# EAGLE design plc-3u-c-r1 (EAGLE 4.16)
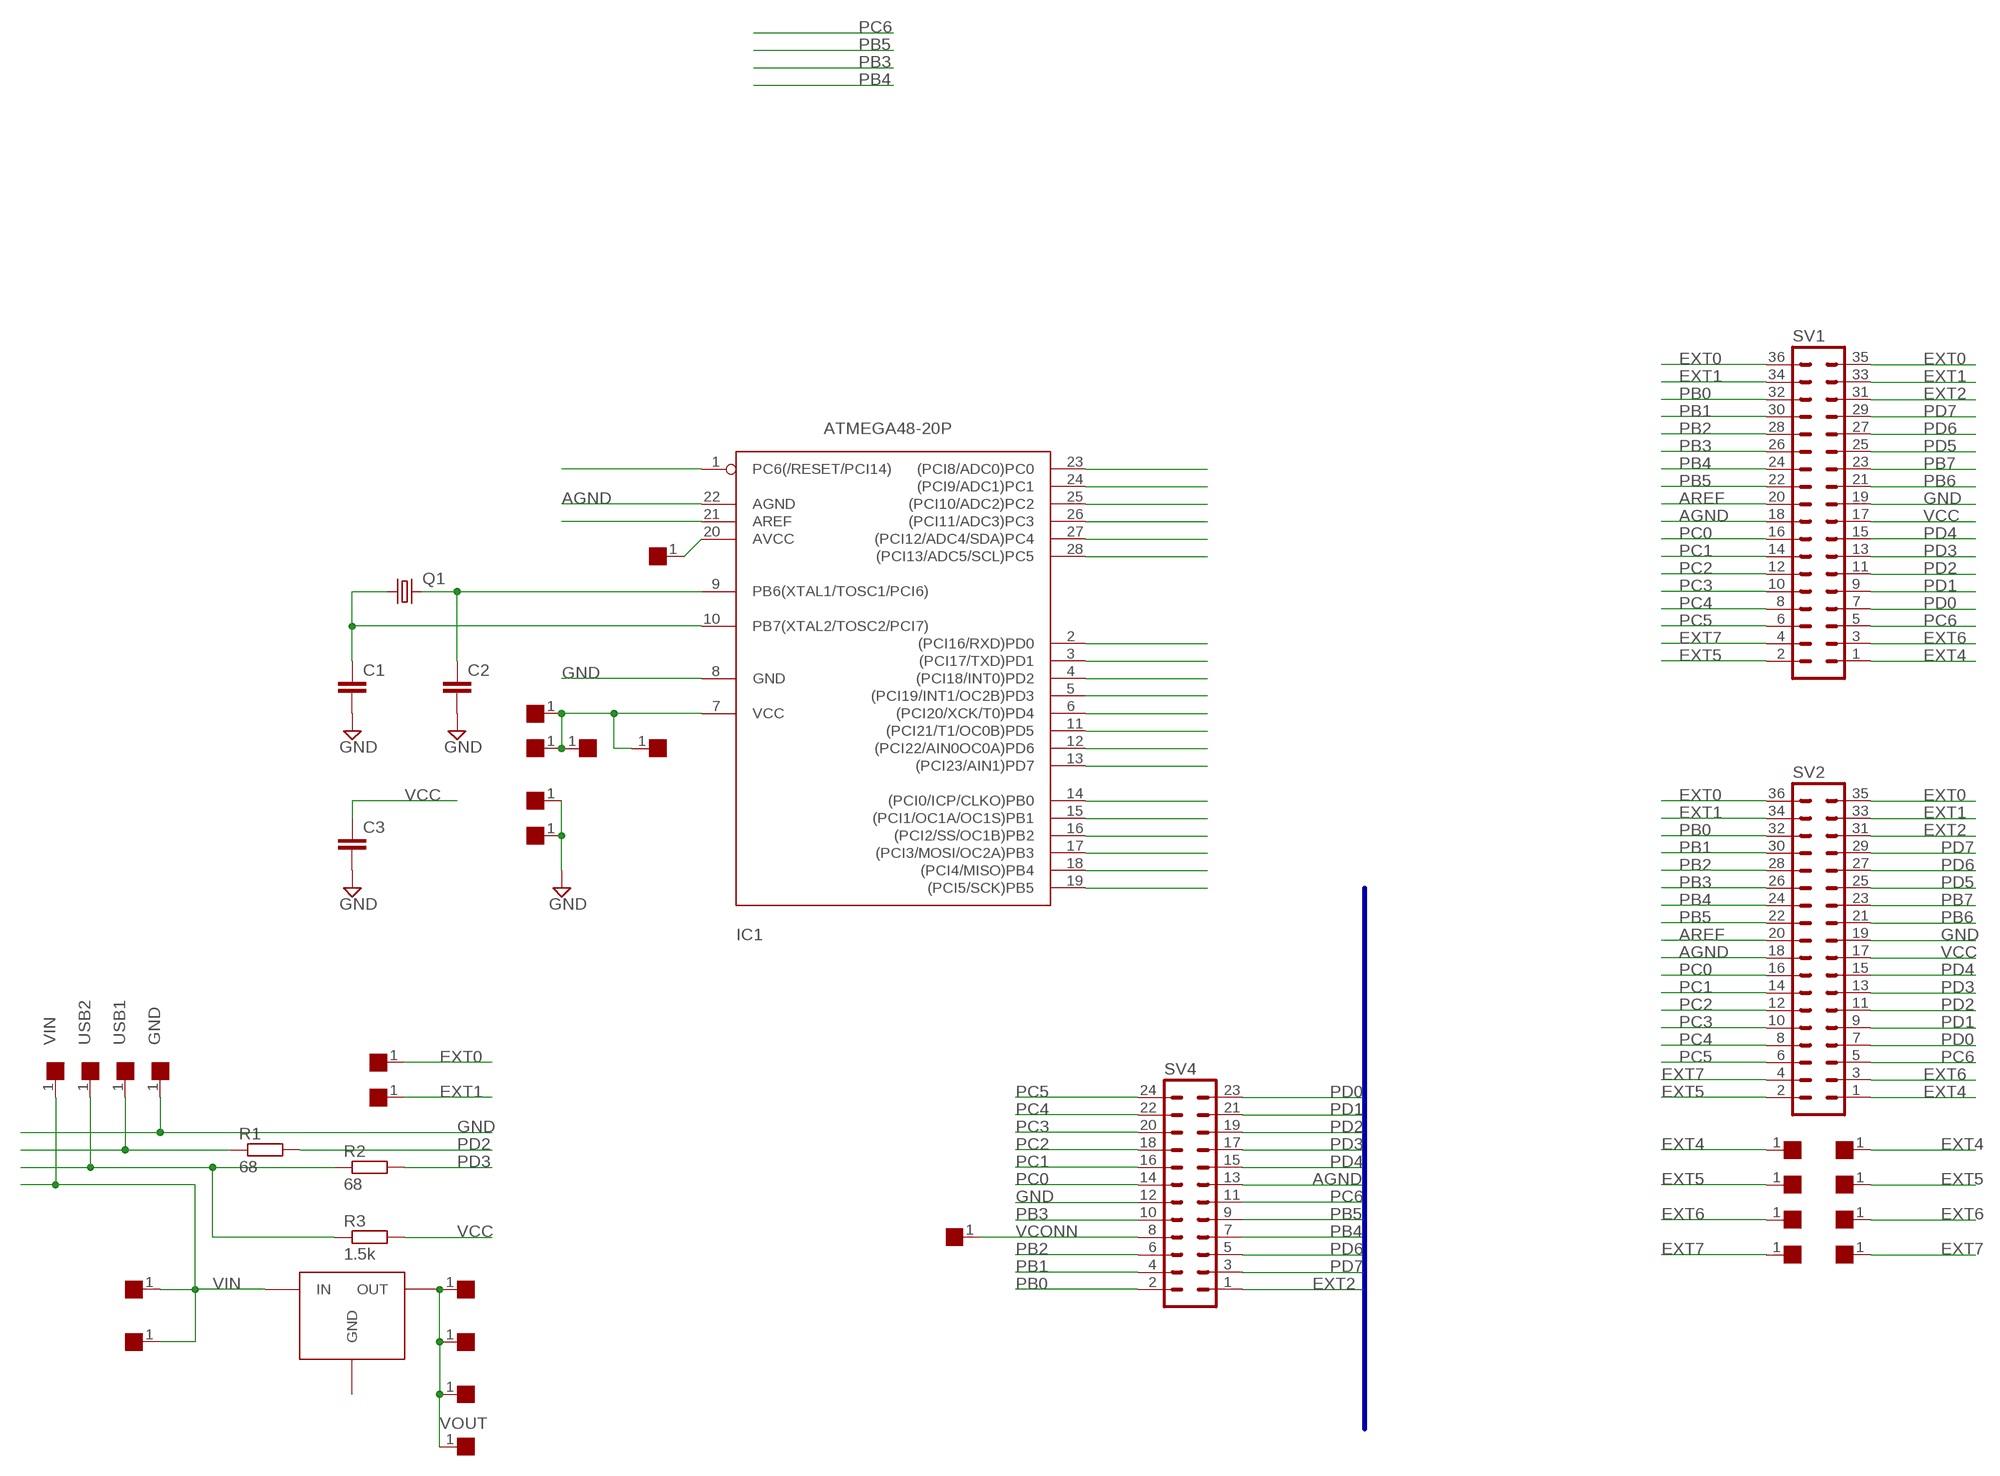
[diagram p0: schematic, sheet 1]

## Parts
C1  C-EUC0805  [C0805]
C2  C-EUC0805  [C0805]
C3  C-EUC1206  [C1206]
IC1  ATMEGA48-20P  [DIL28-3]
Q1  CRYSTALHC49S  [HC49/S]
R1  68  R-EU_R0805  [R0805]
R2  68  R-EU_R0805  [R0805]
R3  1.5k  R-EU_R0805  [R0805]
SV1  MA18-2  [MA18-2]
SV2  MA18-2  [MA18-2]
SV4  MA12-2W  [MA12-2W]
T1  TESTPOINT  [TESTPOIN]
T2  TESTPOINT  [TESTPOIN]
T3  TESTPOINT  [TESTPOIN]
T4  TESTPOINT  [TESTPOIN]
T5  TESTPOINT  [TESTPOIN]
T6  TESTPOINT  [TESTPOIN]
T7  TESTPOINT  [TESTPOIN]
T8  TESTPOINT  [TESTPOIN]
T9  TESTPOINT  [TESTPOIN]
T10  TESTPOINT  [TESTPOIN]
T11  TESTPOINT  [TESTPOIN]
T12  TESTPOINT  [TESTPOIN]
T13  TESTPOINT  [TESTPOIN]
T14  TESTPOINT  [TESTPOIN]
T15  TESTPOINT  [TESTPOIN]
T16  TESTPOINT  [TESTPOIN]
T17  TESTPOINT  [TESTPOIN]
T18  TESTPOINT  [TESTPOIN]
T19  TESTPOINT  [TESTPOIN]
T20  TESTPOINT  [TESTPOIN]
T21  TESTPOINT  [TESTPOIN]
T22  TESTPOINT  [TESTPOIN]
T23  TESTPOINT  [TESTPOIN]
T24  TESTPOINT  [TESTPOIN]
T25  TESTPOINT  [TESTPOIN]
T26  TESTPOINT  [TESTPOIN]
T27  TESTPOINT  [TESTPOIN]
T28  TESTPOINT  [TESTPOIN]
U$1  LF33CDT  [TO-252]

## Nets
AGND: IC1.22(AGND) SV1.18 SV2.18 SV4.13
AREF: IC1.21(AREF) SV1.20 SV2.20
EXT0: SV1.35 SV1.36 SV2.35 SV2.36 T10.1
EXT1: SV1.33 SV1.34 SV2.33 SV2.34 T11.1
EXT2: SV1.31 SV2.31 SV4.1
EXT4: SV1.1 SV2.1 T12.1 T16.1
EXT5: SV1.2 SV2.2 T13.1 T17.1
EXT6: SV1.3 SV2.3 T14.1 T18.1
EXT7: SV1.4 SV2.4 T15.1 T19.1
GND: C1.2 C2.2 C3.2 IC1.8(GND) SV1.19 SV2.19 SV4.12 T7.1 T8.1 T23.1
N$3: IC1.4((PCI18/INT0)PD2)
N$7: IC1.20(AVCC) T2.1
PB0: IC1.14((PCI0/ICP/CLKO)PB0) SV1.32 SV2.32 SV4.2
PB1: IC1.15((PCI1/OC1A/OC1S)PB1) SV1.30 SV2.30 SV4.4
PB2: IC1.16((PCI2/SS/OC1B)PB2) SV1.28 SV2.28 SV4.6
PB3: IC1.17((PCI3/MOSI/OC2A)PB3) SV1.26 SV2.26 SV4.10
PB4: IC1.18((PCI4/MISO)PB4) SV1.24 SV2.24 SV4.7
PB5: IC1.19((PCI5/SCK)PB5) SV1.22 SV2.22 SV4.9
PB6: C2.1 IC1.9(PB6(XTAL1/TOSC1/PCI6)) Q1.2 SV1.21 SV2.21
PB7: C1.1 IC1.10(PB7(XTAL2/TOSC2/PCI7)) Q1.1 SV1.23 SV2.23
PC0: IC1.23((PCI8/ADC0)PC0) SV1.16 SV2.16 SV4.14
PC1: IC1.24((PCI9/ADC1)PC1) SV1.14 SV2.14 SV4.16
PC2: IC1.25((PCI10/ADC2)PC2) SV1.12 SV2.12 SV4.18
PC3: IC1.26((PCI11/ADC3)PC3) SV1.10 SV2.10 SV4.20
PC4: IC1.27((PCI12/ADC4/SDA)PC4) SV1.8 SV2.8 SV4.22
PC5: IC1.28((PCI13/ADC5/SCL)PC5) SV1.6 SV2.6 SV4.24
PC6: IC1.1(PC6(/RESET/PCI14)) SV1.5 SV2.5 SV4.11
PD0: IC1.2((PCI16/RXD)PD0) SV1.7 SV2.7 SV4.23
PD1: IC1.3((PCI17/TXD)PD1) SV1.9 SV2.9 SV4.21
PD2: R1.2 SV1.11 SV2.11 SV4.19
PD3: IC1.5((PCI19/INT1/OC2B)PD3) R2.2 SV1.13 SV2.13 SV4.17
PD4: IC1.6((PCI20/XCK/T0)PD4) SV1.15 SV2.15 SV4.15
PD5: IC1.11((PCI21/T1/OC0B)PD5) SV1.25 SV2.25
PD6: IC1.12((PCI22/AIN0OC0A)PD6) SV1.27 SV2.27 SV4.5
PD7: IC1.13((PCI23/AIN1)PD7) SV1.29 SV2.29 SV4.3
USB1: R1.1 T22.1
USB2: R2.1 R3.1 T21.1
VCC: C3.1 IC1.7(VCC) R3.2 SV1.17 SV2.17 T1.1 T4.1 T5.1 T25.1
VCONN: SV4.8 T28.1
VIN: T20.1 T24.1 T27.1 U$1.1(IN)
VOUT: T3.1 T6.1 T9.1 T26.1 U$1.2(OUT)

## Buses
EXT[0..7]

## Power pins joined to a net without a drawn wire
GND: U$1.3(GND)

## Library data of the parts
C1-C3 = rcl:C-EU: CAPACITOR, European symbol
IC1 = avr:ATMEGA48*P: MICROCONTROLLER 4 Kbytes FLASH 512 Bytes SRAM 256 Bytes EEPROM USART 8-channel 10 bit ADC
Q1 = crystal:CRYSTAL: CRYSTAL
R1-R3 = rcl:R-EU_: RESISTOR, European symbol
SV1 SV2 = con-lstb:MA18-2: PIN HEADER
SV4 = con-lstb:MA12-2W: PIN HEADER
T1-T28 = ADS:TESTPOINT
U$1 = my-to252:LF33CDT

## Board
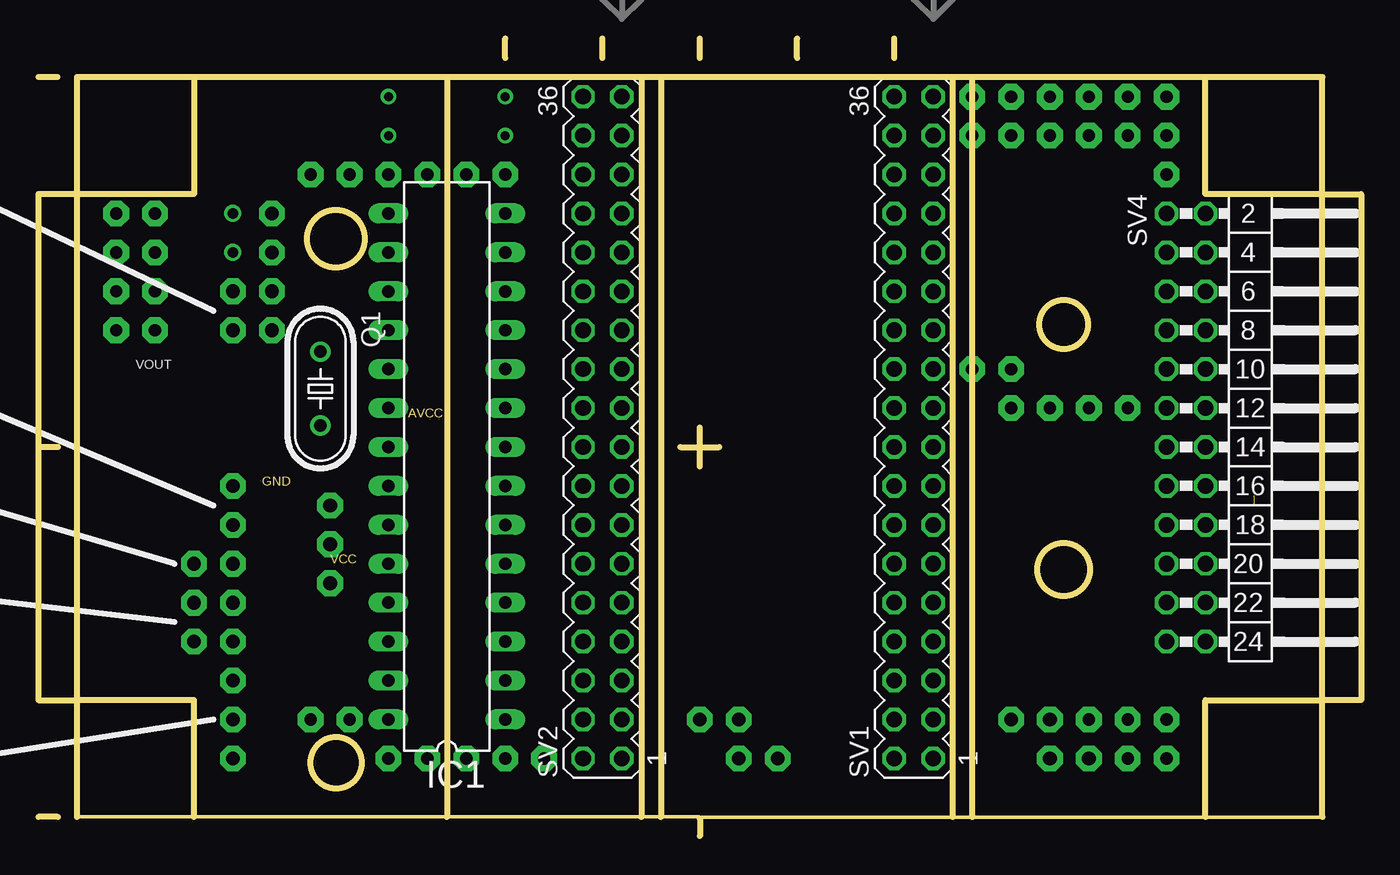
[diagram p1: board, top side]
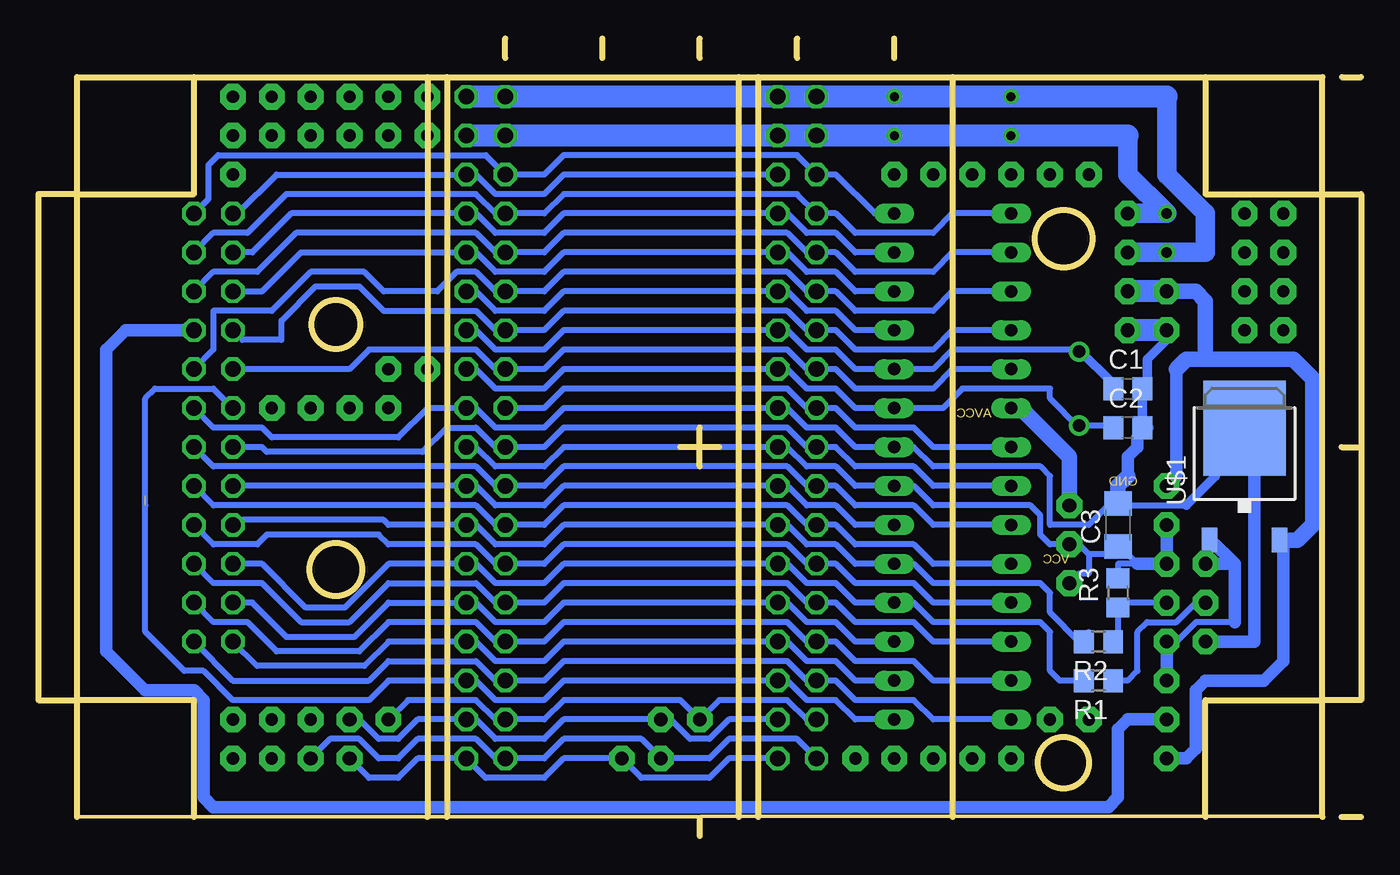
[diagram p2: board, bottom side, seen from below]

Size 86.36 x 52.07 mm. Coordinates in mm from the lower left corner, seen from the top.
Outline: 2.54,1.29 83.82,1.25
Outline: 43.18,1.13 43.18,0
Outline: 1.27,49.53 0,49.53
Outline: 1.27,1.27 0,1.27
Outline: 1.27,25.4 0,25.4
Outline: 41.91,25.4 44.45,25.4
Outline: 43.18,24.13 43.18,26.67
Outline: 2.54,1.27 2.54,8.89
Outline: 2.54,8.89 2.54,41.91
Outline: 2.54,41.91 2.54,49.53 10.16,49.53
Outline: 83.82,1.27 83.82,8.89
Outline: 83.82,8.89 83.82,41.91
Outline: 83.82,41.91 83.82,49.53 76.2,49.53
Outline: 76.2,49.53 60.96,49.53
Outline: 60.96,49.53 59.69,49.53
Outline: 59.69,49.53 40.64,49.53
Outline: 40.64,49.53 39.37,49.53
Outline: 39.37,49.53 26.67,49.53
Outline: 26.67,49.53 10.16,49.53
Outline: 10.16,1.27 10.16,8.89 2.54,8.89
Outline: 76.2,1.27 76.2,8.89 83.82,8.89
Outline: 83.82,41.91 76.2,41.91 76.2,49.53
Outline: 10.16,49.53 10.16,41.91 2.54,41.91
Outline: 2.54,41.91 0,41.91 0,8.89 2.54,8.89
Outline: 83.82,41.91 86.36,41.91 86.36,8.89 83.82,8.89
Outline: 26.67,49.53 26.67,1.27
Outline: 43.18,50.8 43.18,52.07
Outline: 59.69,49.53 59.69,1.27
Outline: 60.96,49.53 60.96,1.27
Outline: 49.53,50.8 49.53,52.07
Outline: 55.88,50.8 55.88,52.07
Outline: 36.83,50.8 36.83,52.07
Outline: 30.48,50.8 30.48,52.07
Outline: 39.37,49.53 39.37,1.27
Outline: 40.64,49.53 40.64,1.27
Outline: circle at 19.43,39 radius 1.86
Outline: circle at 19.43,4.8 radius 1.66
Outline: circle at 66.93,17.4 radius 1.71
Outline: circle at 66.93,33.4 radius 1.57
Copper layers (1*16): Top 0.035mm / dielectric 1.5mm / Bottom 0.035mm
Design rules "default": minimum track width 10mil, minimum drill 24mil, track to track 8mil, track to pad 8mil, pad to pad 8mil, via to via 8mil, smd to smd 8mil, copper to edge 40mil, drill to drill 8mil, minimum pad ring 10mil, minimum via ring 8mil, stop-mask expansion 4mil, vias tented up to drill 0mil, thermal gap 10mil

### Footprints (pad centres in the part's own frame; a part is rotated, then mirrored left to right if it is on the bottom)
C0805 = smd 1.3 x 1.5: 1 -0.95,0; 2 0.95,0
C1206 = smd 1.6 x 1.8: 1 -1.4,0; 2 1.4,0
DIL28-3 = drill 0.813 long: 1 -16.51,-3.81; 2 -13.97,-3.81; 3 -11.43,-3.81; 4 -8.89,-3.81; 5 -6.35,-3.81; 6 -3.81,-3.81; 7 -1.27,-3.81; 8 1.27,-3.81; 9 3.81,-3.81; 10 6.35,-3.81; 11 8.89,-3.81; 12 11.43,-3.81; 13 13.97,-3.81; 14 16.51,-3.81; 15 16.51,3.81; 16 13.97,3.81; 17 11.43,3.81; 18 8.89,3.81; 19 6.35,3.81; 20 3.81,3.81; 21 1.27,3.81; 22 -1.27,3.81; 23 -3.81,3.81; 24 -6.35,3.81; 25 -8.89,3.81; 26 -11.43,3.81; 27 -13.97,3.81; 28 -16.51,3.81
HC49/S = drill 0.813 round: 1 -2.413,0; 2 2.413,0
R0805 = smd 1.3 x 1.5: 1 -0.95,0; 2 0.95,0
MA18-2 = drill 1.016 octagon: 1 -21.59,-1.27; 2 -21.59,1.27; 3 -19.05,-1.27; 4 -19.05,1.27; 5 -16.51,-1.27; 6 -16.51,1.27; 7 -13.97,-1.27; 8 -13.97,1.27; 9 -11.43,-1.27; 10 -11.43,1.27; 11 -8.89,-1.27; 12 -8.89,1.27; 13 -6.35,-1.27; 14 -6.35,1.27; 15 -3.81,-1.27; 16 -3.81,1.27; 17 -1.27,-1.27; 18 -1.27,1.27; 19 1.27,-1.27; 20 1.27,1.27; 21 3.81,-1.27; 22 3.81,1.27; 23 6.35,-1.27; 24 6.35,1.27; 25 8.89,-1.27; 26 8.89,1.27; 27 11.43,-1.27; 28 11.43,1.27; 29 13.97,-1.27; 30 13.97,1.27; 31 16.51,-1.27; 32 16.51,1.27; 33 19.05,-1.27; 34 19.05,1.27; 35 21.59,-1.27; 36 21.59,1.27
MA12-2W = drill 1.016 octagon: 1 -13.97,-1.27; 2 -13.97,1.27; 3 -11.43,-1.27; 4 -11.43,1.27; 5 -8.89,-1.27; 6 -8.89,1.27; 7 -6.35,-1.27; 8 -6.35,1.27; 9 -3.81,-1.27; 10 -3.81,1.27; 11 -1.27,-1.27; 12 -1.27,1.27; 13 1.27,-1.27; 14 1.27,1.27; 15 3.81,-1.27; 16 3.81,1.27; 17 6.35,-1.27; 18 6.35,1.27; 19 8.89,-1.27; 20 8.89,1.27; 21 11.43,-1.27; 22 11.43,1.27; 23 13.97,-1.27; 24 13.97,1.27
TESTPOIN = drill 0.889 pad 1.676 octagon: 1 0,0
TO-252 = smd 1 x 1.6: 1 -2.28,-6.07; 2 2.28,-6.07 | smd 5.4 x 6.2: 3 0,1.23

### Placement (x,y rotation side)
C1  15.24,29.21 0 bottom
C2  15.24,26.67 0 bottom
C3  15.88,20.32 90 bottom
IC1  26.67,24.13 90 top
Q1  18.41,29.21 270 top
R1  17.14,10.16 180 bottom
R2  17.14,12.7 180 bottom
R3  15.88,15.88 90 bottom
SV1  57.15,26.67 90 top
SV2  36.83,26.67 90 top
SV4  74.93,26.67 270 top
T1  19.05,19.05 0 top
T2  19.05,21.59 0 top
T3  12.7,22.86 0 top
T4  12.7,20.32 0 top
T5  19.05,16.51 0 top
T6  12.7,35.56 0 top
T7  12.7,33.02 0 top
T8  15.24,33.02 0 top
T9  15.24,35.56 0 top
T10  15.24,38.1 0 top
T11  15.24,40.64 0 top
T12  48.26,5.08 0 top
T13  45.72,5.08 0 top
T14  45.72,7.62 0 top
T15  43.18,7.62 0 top
T16  66.04,5.08 0 top
T17  68.58,5.08 0 top
T18  66.04,7.62 0 top
T19  63.5,7.62 0 top
T20  12.7,12.7 0 top
T21  12.7,15.24 0 top
T22  10.16,15.24 0 top
T23  10.16,12.7 0 top
T24  10.16,17.78 0 top
T25  12.7,17.78 0 top
T26  12.7,5.08 0 top
T27  12.7,10.16 0 top
T28  12.7,7.62 0 top
U$1  7.62,25.4 0 bottom

### Tracks (layer width: path | path; a pad name or v marks a point on that pad's centre or on a via)
AGND
  Bottom 0.406: IC1.22 27.94,22.86 29.21,24.13 33.02,24.13 34.29,25.4 SV2.18 36.2,25.4 37.46,26.67 52.07,26.67 53.34,25.4 SV1.18 56.52,25.4 57.78,26.67 59.69,26.67 61.28,25.08 71.44,25.08 71.76,25.4 SV4.13
AREF
  Bottom 0.406: IC1.21 27.94,25.4 29.21,26.67 33.02,26.67 34.29,27.94 SV2.20 36.2,27.94 37.46,29.21 52.07,29.21 53.34,27.94 SV1.20
EXT0  (via drill 0.6)
  Bottom 1.27: 12.7,48.26 12.7,43.18 10.16,40.64 10.16,38.1 T10.1
  Bottom 1.422: SV1.35 SV1.36 SV2.35 SV2.36 v30.48,48.26 v22.86,48.26 12.7,48.26
EXT1  (via drill 0.6)
  Bottom 1.27: 15.24,45.72 15.24,43.18 12.7,40.64 T11.1
  Bottom 1.422: 15.24,45.72 v22.86,45.72 v30.48,45.72 SV2.34 SV2.33 SV1.34 SV1.33
EXT2
  Bottom 0.406: SV2.31 52.07,43.18 53.34,41.91 56.52,41.91 57.78,43.18 SV1.31 58.42,43.5 58.74,43.18 70.8,43.18 73.34,40.64 SV4.1
EXT4
  Bottom 0.406: SV2.1 41.27,5.08 42.55,3.81 46.99,3.81 T12.1 52.07,5.08 53.34,3.81 57.15,3.81 SV1.1 61.59,5.08 62.87,3.81 64.77,3.81 T16.1
EXT5
  Bottom 0.406: SV2.2 36.83,6.35 41.27,6.35 42.55,5.08 T13.1 46.99,6.35 52.07,6.35 53.34,5.08 SV1.2 56.52,5.08 57.78,6.35 61.59,6.35 62.87,5.08 64.14,5.08 65.41,6.35 67.31,6.35 T17.1
EXT6
  Bottom 0.406: SV2.3 41.27,7.62 42.55,6.35 43.81,6.35 45.09,7.62 T14.1 52.07,7.62 53.34,6.35 56.52,6.35 57.78,7.62 SV1.3 61.59,7.62 62.87,6.35 64.14,6.35 65.41,7.62 T18.1
EXT7
  Bottom 0.406: SV2.4 36.2,7.62 37.46,8.89 41.91,8.89 T15.1 44.45,8.89 52.07,8.89 53.34,7.62 SV1.4 56.52,7.62 57.78,8.89 62.23,8.89 T19.1
GND
  Bottom 0.254: U$1.3 8.89,26.67 8.57,26.35
  Bottom 0.406: 13.97,26.67 14.29,26.99 | 8.29,26.63 8.57,26.35 8.25,26.04 9.53,24.77 9.53,23.5 | SV4.12 74.93,26.67 71.76,26.67 71.12,26.04 62.87,26.04 60.96,27.94 SV1.19 57.78,27.94 56.52,26.67 53.34,26.67 52.07,27.94 SV2.19 37.46,27.94 36.2,26.67 34.29,26.67 33.02,25.4 IC1.8 29.21,25.4 27.94,24.13 20.95,24.13 20.32,23.5 20.32,20.32 17.78,20.32 16.51,21.59 15.88,21.59 | U$1.3 7.62,26.67 6.99,26.04 | C3.2 15.88,21.59 | 15.88,21.59 11.43,21.59
  Bottom 0.61: 14.29,26.99 14.29,28.89 13.97,29.21 C1.2 14.61,29.21 13.97,29.84 13.97,31.11 12.7,32.38 T7.1 | 11.43,21.59 9.53,23.5
  Bottom 0.813: T23.1 6.99,12.7 6.99,26.04 | 15.24,23.5 15.24,24.77 14.61,25.4 14.61,26.04 13.97,26.67 C2.2
  Bottom 1.016: C3.2 15.88,22.86 15.24,23.5
  Bottom 1.422: T7.1 T8.1
N$5  (via drill 0.8 pad 1.68)
  other vias: 60.96,48.26
N$7
  Bottom 0.406: 22.22,27.94 IC1.20
  Bottom 1.016: 22.22,27.94 19.05,24.77 T2.1
N$9  (via drill 0.7)
  other vias: 12.7,38.1
N$10  (via drill 0.7)
  other vias: 12.7,40.64
N$11  (via drill 0.8 pad 1.68)
  other vias: 60.96,45.72
N$12  (via drill 0.8 pad 1.68)
  other vias: 63.5,45.72
N$13  (via drill 0.8 pad 1.68)
  other vias: 66.04,45.72
N$14  (via drill 0.8 pad 1.68)
  other vias: 63.5,48.26
N$15  (via drill 0.8 pad 1.68)
  other vias: 66.04,48.26
N$16  (via drill 0.8 pad 1.68)
  other vias: 68.58,45.72
N$17  (via drill 0.8 pad 1.68)
  other vias: 68.58,48.26
N$18  (via drill 0.8 pad 1.68)
  other vias: 71.12,48.26
N$19  (via drill 0.8 pad 1.68)
  other vias: 71.12,45.72
N$20  (via drill 0.8 pad 1.68)
  other vias: 73.66,48.26
N$21  (via drill 0.8 pad 1.68)
  other vias: 73.66,45.72
N$22  (via drill 0.8 pad 1.68)
  other vias: 73.66,43.18
N$23  (via drill 0.8 pad 1.68)
  other vias: 71.12,27.94
N$24  (via drill 0.8 pad 1.68)
  other vias: 68.58,27.94
N$25  (via drill 0.8 pad 1.68)
  other vias: 66.04,27.94
N$26  (via drill 0.8 pad 1.68)
  other vias: 63.5,27.94
N$27  (via drill 0.8 pad 1.68)
  other vias: 63.5,30.48
N$28  (via drill 0.8 pad 1.68)
  other vias: 60.96,30.48
N$29  (via drill 0.8 pad 1.68)
  other vias: 68.58,7.62
N$30  (via drill 0.8 pad 1.68)
  other vias: 71.12,7.62
N$31  (via drill 0.8 pad 1.68)
  other vias: 73.66,7.62
N$32  (via drill 0.8 pad 1.68)
  other vias: 73.66,5.08
N$33  (via drill 0.8 pad 1.68)
  other vias: 71.12,5.08
N$34  (via drill 0.8 pad 1.68)
  other vias: 22.86,5.08
N$35  (via drill 0.8 pad 1.68)
  other vias: 25.4,5.08
N$36  (via drill 0.8 pad 1.68)
  other vias: 27.94,5.08
N$37  (via drill 0.8 pad 1.68)
  other vias: 30.48,5.08
N$38  (via drill 0.8 pad 1.68)
  other vias: 33.02,5.08
N$39  (via drill 0.8 pad 1.68)
  other vias: 20.32,7.62
N$40  (via drill 0.8 pad 1.68)
  other vias: 17.78,7.62
N$41  (via drill 0.8 pad 1.68)
  other vias: 22.86,43.18
N$42  (via drill 0.8 pad 1.68)
  other vias: 20.32,43.18
N$43  (via drill 0.8 pad 1.68)
  other vias: 17.78,43.18
N$44  (via drill 0.8 pad 1.68)
  other vias: 25.4,43.18
N$45  (via drill 0.8 pad 1.68)
  other vias: 27.94,43.18
N$46  (via drill 0.8 pad 1.68)
  other vias: 30.48,43.18
N$47  (via drill 0.8 pad 1.68)
  other vias: 7.62,40.64
N$48  (via drill 0.8 pad 1.68)
  other vias: 5.08,40.64
N$49  (via drill 0.8 pad 1.68)
  other vias: 5.08,38.1
N$50  (via drill 0.8 pad 1.68)
  other vias: 7.62,38.1
N$51  (via drill 0.8 pad 1.68)
  other vias: 7.62,35.56
N$52  (via drill 0.8 pad 1.68)
  other vias: 5.08,35.56
N$53  (via drill 0.8 pad 1.68)
  other vias: 5.08,33.02
N$54  (via drill 0.8 pad 1.68)
  other vias: 7.62,33.02
PB0
  Bottom 0.406: IC1.14 31.75,40.64 34.29,43.18 SV2.32 36.83,44.45 52.07,44.45 53.34,43.18 SV1.32 57.15,44.45 74.61,44.45 75.25,43.81 75.25,41.59 SV4.2
PB1
  Bottom 0.406: IC1.15 26.67,40.64 27.94,39.37 33.02,39.37 34.29,40.64 SV2.30 36.83,41.91 52.07,41.91 53.34,40.64 SV1.30 56.52,40.64 57.78,41.91 70.17,41.91 72.71,39.37 74.93,39.37 SV4.4
PB2
  Bottom 0.406: IC1.16 26.67,38.1 27.94,36.83 33.02,36.83 34.29,38.1 SV2.28 36.2,38.1 37.46,39.37 52.07,39.37 53.34,38.1 SV1.28 56.52,38.1 57.78,39.37 69.53,39.37 72.07,36.83 74.93,36.83 SV4.6
PB3
  Bottom 0.406: IC1.17 26.67,35.56 27.94,34.29 33.02,34.29 34.29,35.56 SV2.26 36.2,35.56 37.46,36.83 52.07,36.83 53.34,35.56 SV1.26 56.52,35.56 57.78,36.83 59.05,36.83 60.32,35.56 63.82,35.56 65.09,36.83 68.58,36.83 71.12,34.29 74.93,34.29 74.93,31.75 SV4.10
PB4
  Bottom 0.406: IC1.18 26.67,33.02 27.94,31.75 33.02,31.75 34.29,33.02 SV2.24 36.2,33.02 37.46,34.29 52.07,34.29 53.34,33.02 SV1.24 56.52,33.02 57.78,34.29 63.82,34.29 65.41,35.88 68.26,35.88 70.48,33.66 70.48,32.38 73.03,32.38 SV4.7
PB5
  Bottom 0.406: IC1.19 26.67,30.48 27.94,29.21 33.02,29.21 34.29,30.48 SV2.22 36.2,30.48 37.46,31.75 52.07,31.75 53.34,30.48 SV1.22 56.52,30.48 57.78,31.75 64.77,31.75 66.04,30.48 SV4.9
PB6
  Bottom 0.406: SV1.21 57.78,30.48 56.52,29.21 53.34,29.21 52.07,30.48 SV2.21 37.46,30.48 36.2,29.21 34.29,29.21 33.02,27.94 IC1.9 27.3,27.94 26.04,29.21 20.32,29.21 20.32,28.57 18.41,26.67 Q1.2 16.64,26.8 16.51,26.67 C2.1
PB7
  Bottom 0.406: SV1.23 57.78,33.02 56.52,31.75 53.34,31.75 52.07,33.02 SV2.23 37.46,33.02 36.2,31.75 34.29,31.75 33.02,30.48 IC1.10 27.94,30.48 26.67,31.75 18.41,31.75
  Bottom 0.61: Q1.1 18.41,31.75 16.19,29.52 C1.1
PC0
  Bottom 0.406: IC1.23 27.94,20.32 29.21,21.59 33.02,21.59 34.29,22.86 SV2.16 36.2,22.86 37.46,24.13 52.07,24.13 53.34,22.86 SV1.16 56.52,22.86 57.78,24.13 74.93,24.13 SV4.14
PC1
  Bottom 0.406: IC1.24 27.94,17.78 29.21,19.05 33.02,19.05 34.29,20.32 SV2.14 36.2,20.32 37.46,21.59 52.07,21.59 53.34,20.32 SV1.14 56.52,20.32 57.78,21.59 74.93,21.59 SV4.16
PC2
  Bottom 0.406: IC1.25 27.94,15.24 29.21,16.51 33.02,16.51 34.29,17.78 SV2.12 36.2,17.78 37.46,19.05 52.07,19.05 53.34,17.78 SV1.12 56.52,17.78 57.78,19.05 63.5,19.05 64.14,19.68 71.44,19.68 72.07,19.05 74.93,19.05 SV4.18
PC3
  Bottom 0.406: IC1.26 27.94,12.7 29.21,13.97 33.02,13.97 34.29,15.24 SV2.10 36.2,15.24 37.46,16.51 52.07,16.51 53.34,15.24 SV1.10 56.52,15.24 57.78,16.51 63.5,16.51 66.04,13.97 69.22,13.97 71.76,16.51 74.93,16.51 SV4.20
PC4
  Bottom 0.406: IC1.27 27.94,10.16 29.21,11.43 33.02,11.43 34.29,12.7 SV2.8 36.2,12.7 37.46,13.97 52.07,13.97 53.34,12.7 SV1.8 56.52,12.7 57.78,13.97 63.5,13.97 65.41,12.06 70.8,12.06 72.71,13.97 74.93,13.97 SV4.22
PC5
  Bottom 0.406: IC1.28 27.94,7.62 29.21,8.89 33.02,8.89 34.29,10.16 SV2.6 36.2,10.16 37.46,11.43 52.07,11.43 53.34,10.16 SV1.6 56.52,10.16 57.78,11.43 63.5,11.43 64.77,10.16 73.66,10.16 SV4.24
PC6  (1 unrouted)
  Bottom 0.406: IC1.1 33.02,7.62 34.29,8.89 36.2,8.89 37.46,10.16 SV2.5 52.07,10.16 53.34,8.89 56.52,8.89 57.78,10.16 SV1.5 63.5,10.16 64.77,8.89 73.66,8.89 75.57,10.79 76.84,10.79 79.38,13.34 79.38,21.59 79.38,28.57 78.74,29.21 74.93,29.21 SV4.11
PD0
  Bottom 0.406: IC1.2 33.02,10.16 34.29,11.43 36.2,11.43 37.46,12.7 SV2.7 52.07,12.7 53.34,11.43 56.52,11.43 57.78,12.7 SV1.7 63.5,12.7 65.09,11.11 72.07,11.11 SV4.23
PD1
  Bottom 0.406: IC1.3 33.02,12.7 34.29,13.97 36.2,13.97 37.46,15.24 SV2.9 52.07,15.24 53.34,13.97 56.52,13.97 57.78,15.24 SV1.9 63.5,15.24 65.72,13.02 70.17,13.02 72.39,15.24 SV4.21
PD2
  Bottom 0.406: R1.2 19.68,10.16 20.32,10.79 20.32,13.34 20.95,13.97 27.94,13.97 29.21,15.24 33.02,15.24 34.29,16.51 36.2,16.51 37.46,17.78 SV2.11 52.07,17.78 53.34,16.51 56.52,16.51 57.78,17.78 SV1.11 63.5,17.78 66.36,14.92 68.9,14.92 71.76,17.78 SV4.19
PD3
  Bottom 0.406: 17.78,13.34 R2.2 18.41,12.7 20.32,14.61 20.32,15.88 20.95,16.51 27.94,16.51 29.21,17.78 IC1.5 33.02,17.78 34.29,19.05 36.2,19.05 37.46,20.32 SV2.13 52.07,20.32 53.34,19.05 56.52,19.05 57.78,20.32 SV1.13 63.5,20.32 63.82,20.64 73.03,20.64 73.34,20.32 SV4.17
PD4
  Bottom 0.406: IC1.6 33.02,20.32 34.29,21.59 36.2,21.59 37.46,22.86 SV2.15 52.07,22.86 53.34,21.59 56.52,21.59 57.78,22.86 SV1.15 SV4.15
PD5
  Bottom 0.406: IC1.11 33.02,33.02 34.29,34.29 36.2,34.29 37.46,35.56 SV2.25 52.07,35.56 53.34,34.29 56.52,34.29 57.78,35.56 SV1.25
PD6
  Bottom 0.406: IC1.12 33.02,35.56 34.29,36.83 36.2,36.83 37.46,38.1 SV2.27 52.07,38.1 53.34,36.83 56.52,36.83 57.78,38.1 58.1,38.1 | SV4.5 71.76,35.56 69.22,38.1 58.1,38.1 | 58.1,38.1 SV1.27
PD7
  Bottom 0.406: IC1.13 33.02,38.1 34.29,39.37 36.2,39.37 37.46,40.64 SV2.29 52.07,40.64 53.34,39.37 56.52,39.37 57.78,40.64 SV1.29 69.85,40.64 72.39,38.1 SV4.3
USB1
  Bottom 0.406: T22.1 10.8,15.24 12.07,13.97 13.97,13.97 14.61,13.34 14.61,10.79 15.24,10.16 R1.1
USB2
  Bottom 0.406: R2.1 15.88,12.7 R3.1 15.88,15.24 T21.1
VCC
  Bottom 0.406: SV1.17 57.78,25.4 56.52,24.13 53.34,24.13 52.07,25.4 SV2.17 37.46,25.4 36.2,24.13 34.29,24.13 33.02,22.86 IC1.7 29.21,22.86 27.94,21.59 21.59,21.59 20.95,20.95 20.95,19.68 20.32,19.05 T1.1 18.41,19.05 17.78,18.41 | 17.78,18.41 15.88,18.41 C3.1 15.11,18.29 14.61,17.78 15.88,17.78 R3.2 15.88,16.51 | 17.78,18.41 17.78,17.14 18.41,17.14 T5.1
  Bottom 0.813: 14.61,17.78 T25.1 T4.1
VCONN
  Bottom 0.813: T28.1 15.24,7.62 15.88,6.99 15.88,2.54 16.51,1.91 74.93,1.91 75.57,2.54 75.57,8.89 76.2,9.53 79.38,9.53 81.92,12.06 81.92,31.75 80.65,33.02 SV4.8
VIN
  Bottom 0.406: 9.8,19.33 U$1.1 | T20.1 12.07,12.7 10.8,13.97 8.25,13.97
  Bottom 0.813: 8.25,17.78 9.8,19.33 | 8.25,13.97 8.25,17.78 | 8.25,17.78 T24.1 | T20.1 T27.1
VOUT
  Bottom 0.813: 12.07,30.48 12.07,23.5 T3.1 | T26.1 11.43,5.08 10.8,5.71 10.8,9.53 10.16,10.16 6.35,10.16 5.08,11.43 5.08,19.05 5.34,19.31 U$1.2
  Bottom 1.016: U$1.2 4.17,19.33 3.17,20.32 3.17,29.84 4.45,31.11 10.16,31.11 | 10.16,31.11 11.43,31.11 12.07,30.48 | T6.1 10.8,35.56 10.16,34.92 10.16,31.11
  Bottom 1.422: T6.1 T9.1

### Text on the board
Dimension: AVCC | GND | VCC
tPlace: VOUT | * SHORT JUMPER [VIN, VCC] TO POWER THE MCU DIRECTLY FROM USB POWER PINS (5V). REGULATOR WILL NOT BE USED
tOrigins: VOUT | GND | EXT2 | PB0 | PD7 | PB1 | VOUT | PD6 | PB2/SS | VOUT | GND | PB4/MISO | VCONN | PB5/SCK | PB3/MOSI | VCC | PC6/RESET | GND | AGND | PC0/ADC0 | VIN | VCC | PD4 | PC1/ADC1 | PD3 | PC2/ADC2 | USB | USB | VIN | PD2 | PC3/ADC3 | PD1/TXD | PC4/SDA | GND | VIN | PD0/RXD | PC5/SCL | VIN | VCONN | VOUT | * SHORT JUMPER [VOUT, VCC] TO POWER THE MCU DIRECTLY FROM POWER SUPPLY PINS. REGULATOR WILL NOT BE USED
Measures: 49.53 | 39 | 33.4 | 25.4 | 48.26 | 16 | 17.4 | 4.8 | 1.27 | 0 | 16.89 | 40.64 | 64.39 | 81.28 | 47.5